# EasyEDA schematic system rfid online.json
TITLE: System RFID Online; REV: 1.0; Date: 2022-04-06; Sheet: 1/1; Drawn By: ELIGIO & SAUL; Company: sistemasmicocontrolados.com
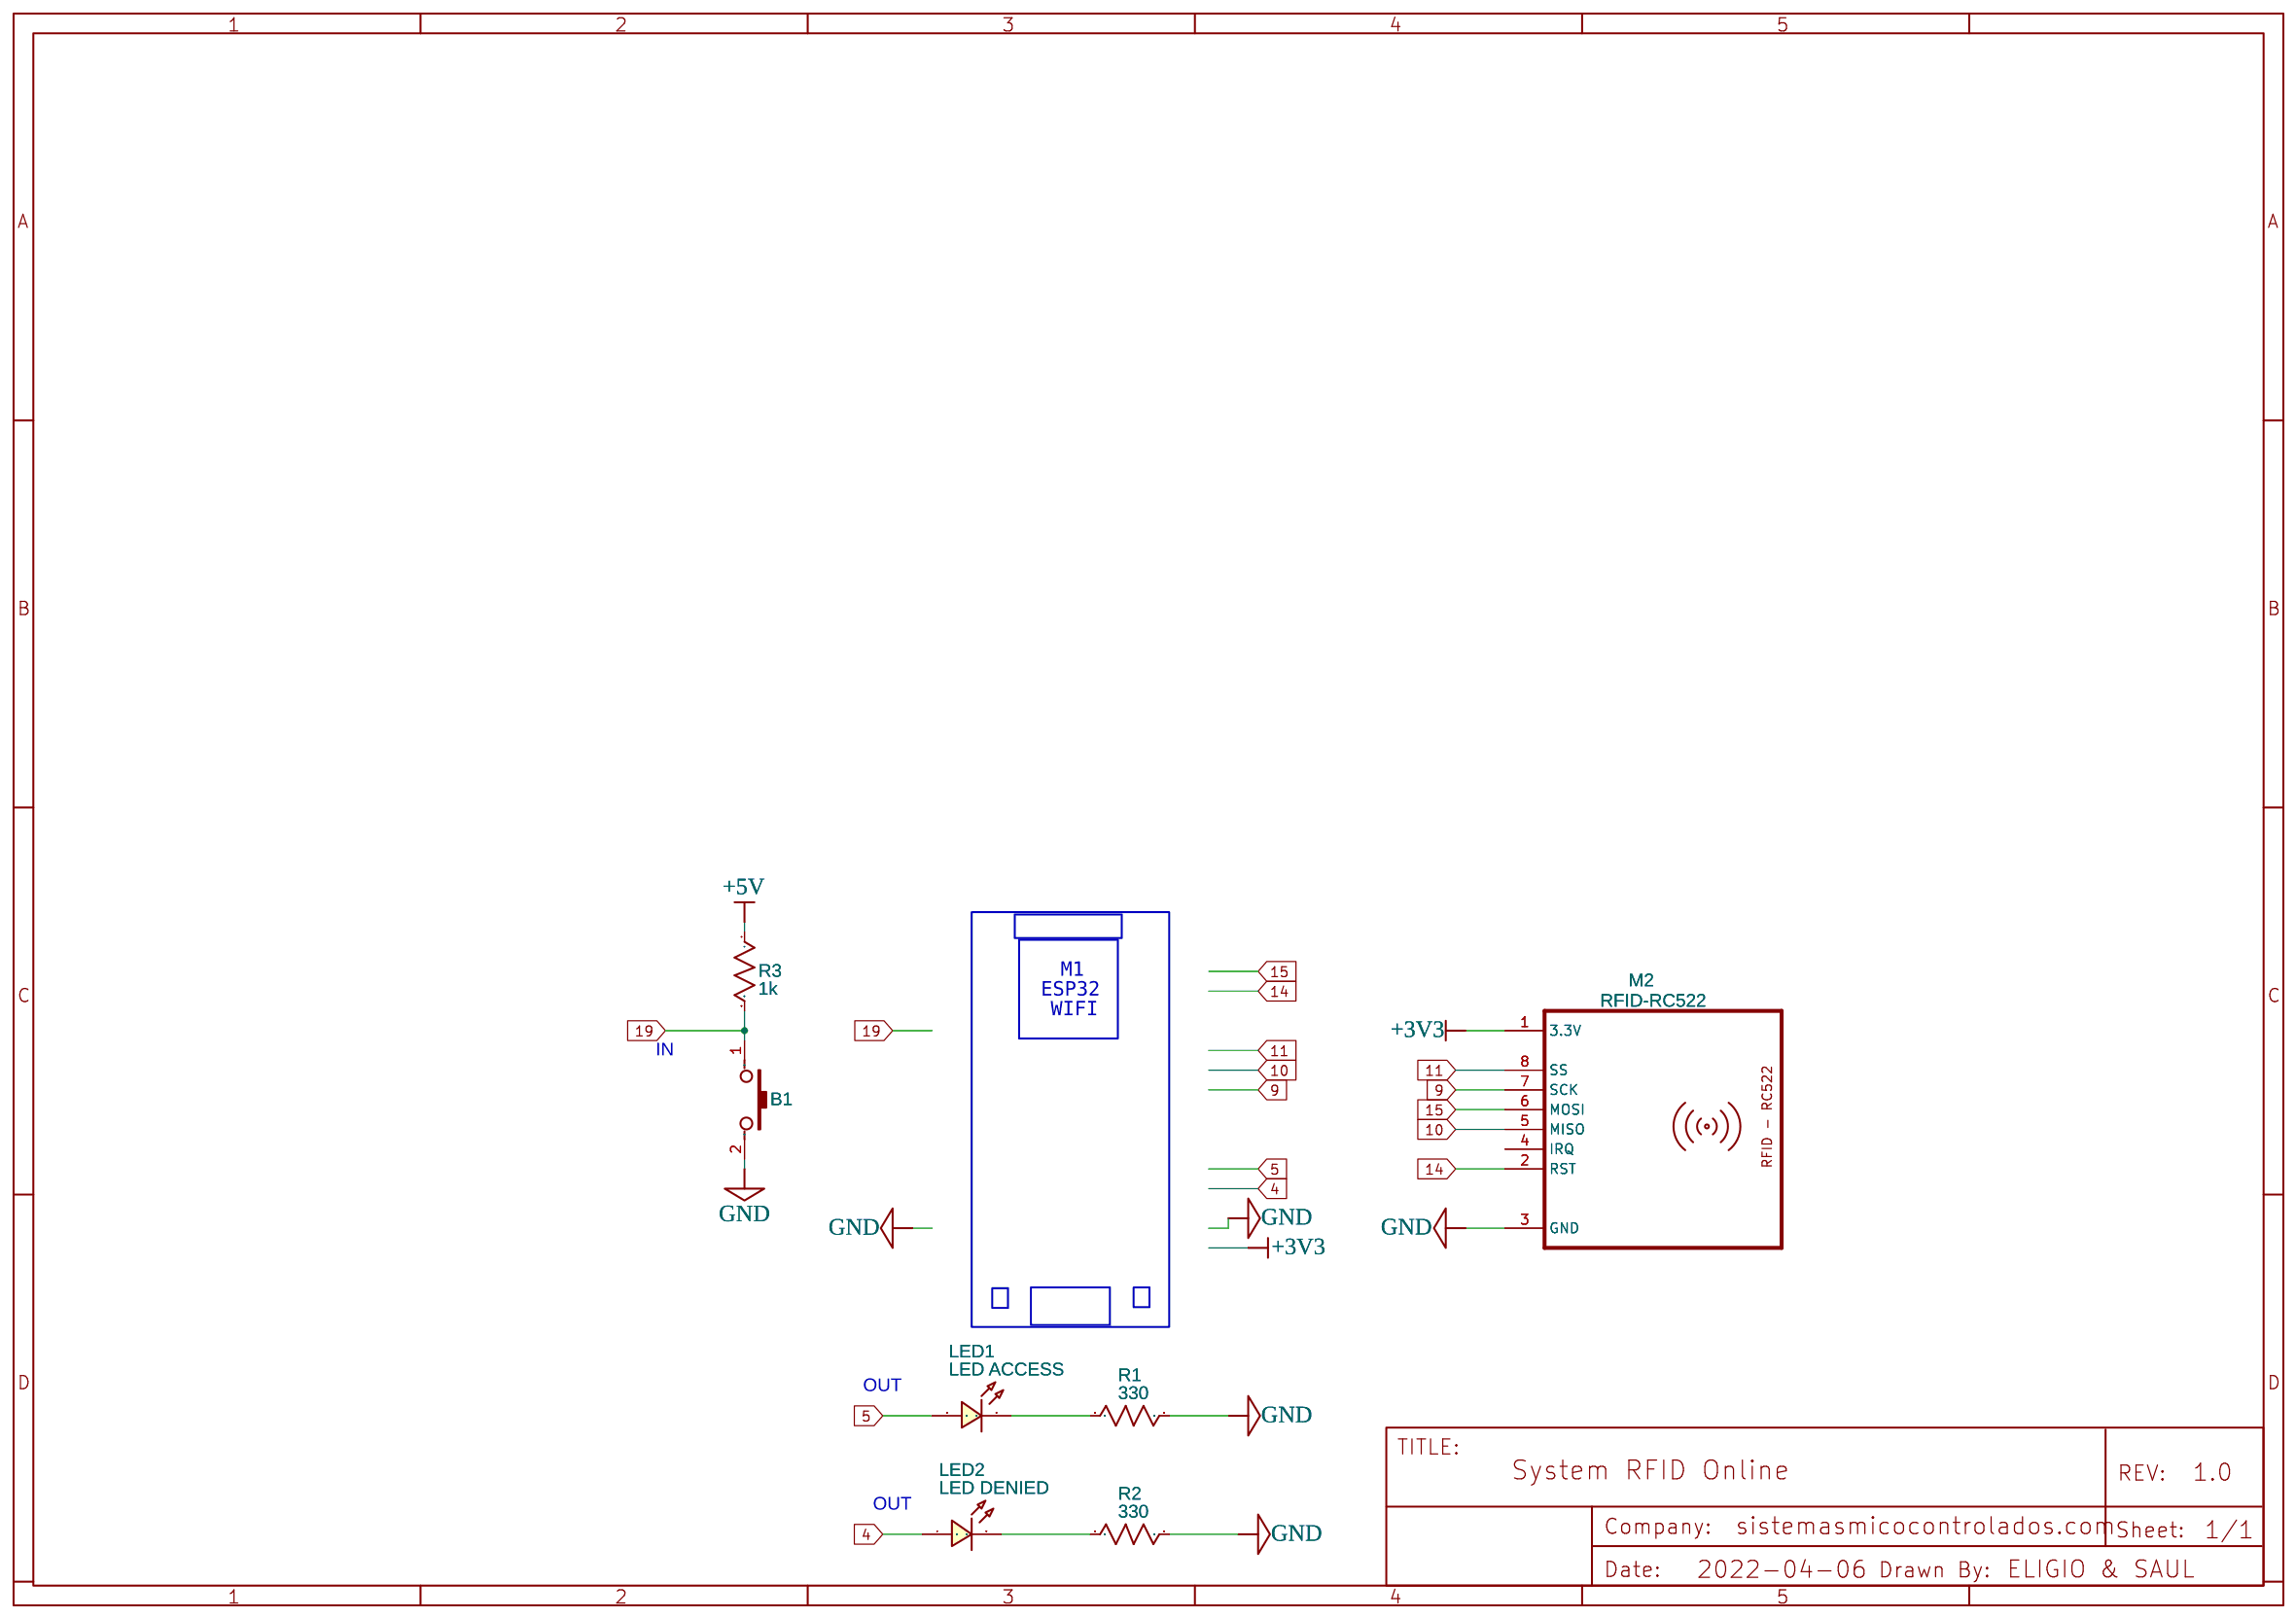
[diagram p0: schematic sheet]

## Parts
B1  BotonProto1x2  [BOTON-PRO-1X2]
LED1  LED ACCESS  [LED-TH_BD5.0_GREEN]
LED2  LED DENIED  [LED-TH_BD5.0_RED]
M2  RFID-RC522  [RFID-RC522]
R1  330  [R_AXIAL-1.0]
R2  330  [R_AXIAL-1.0]
R3  1k  [R_AXIAL-1.0]

## Library data of the parts
B1 = BotonProto1x2: Manufacturer Part: ESP-12F(ESP8266MOD); Supplier: tostratonic; Supplier Part: BTMWESP; Contributor: MotoTripa22
LED1 = LED-TH-5mm_G: Manufacturer: EVERLIGHT(台湾亿光); Manufacturer Part: 333-2SYGD/S530-E2; Supplier Part: C88163; Supplier: LCSC; Contributor: LCEDA_Lib
LED2 = LED-TH-5mm_R: Manufacturer: EVERLIGHT(台湾亿光); Manufacturer Part: 333-2SURD/S530-A3; Supplier Part: C87271; Supplier: LCSC; Contributor: LCEDA_Lib
M2 = RFID-RC522_without hols: Contributor: Daan de Dios
R1-R3 = R_AXIAL-1.0_US: Contributor: LCEDA_Lib

## Nets
+3V3: M2.1(3.3V)
+5V: R3.1
GND: B1.2 M2.3(GND) R1.2 R2.2
4: LED2.1
5: LED1.1
9: M2.7(SCK)
10: M2.5(MISO)
11: M2.8(SS)
14: M2.2(RST)
15: M2.6(MOSI)
19: B1.1 R3.2
Net-(LED1-2): LED1.2 R1.1
Net-(LED2-2): LED2.2 R2.1

Not connected (* = marked no-connect by the designer): M2 4(IRQ)

## Notes on the sheet
- M1
- ESP32
- WIFI
- IN
- OUT
- OUT
